# Altium schematic sheet DISPLAYPORT_USBC.SchDoc
size A3
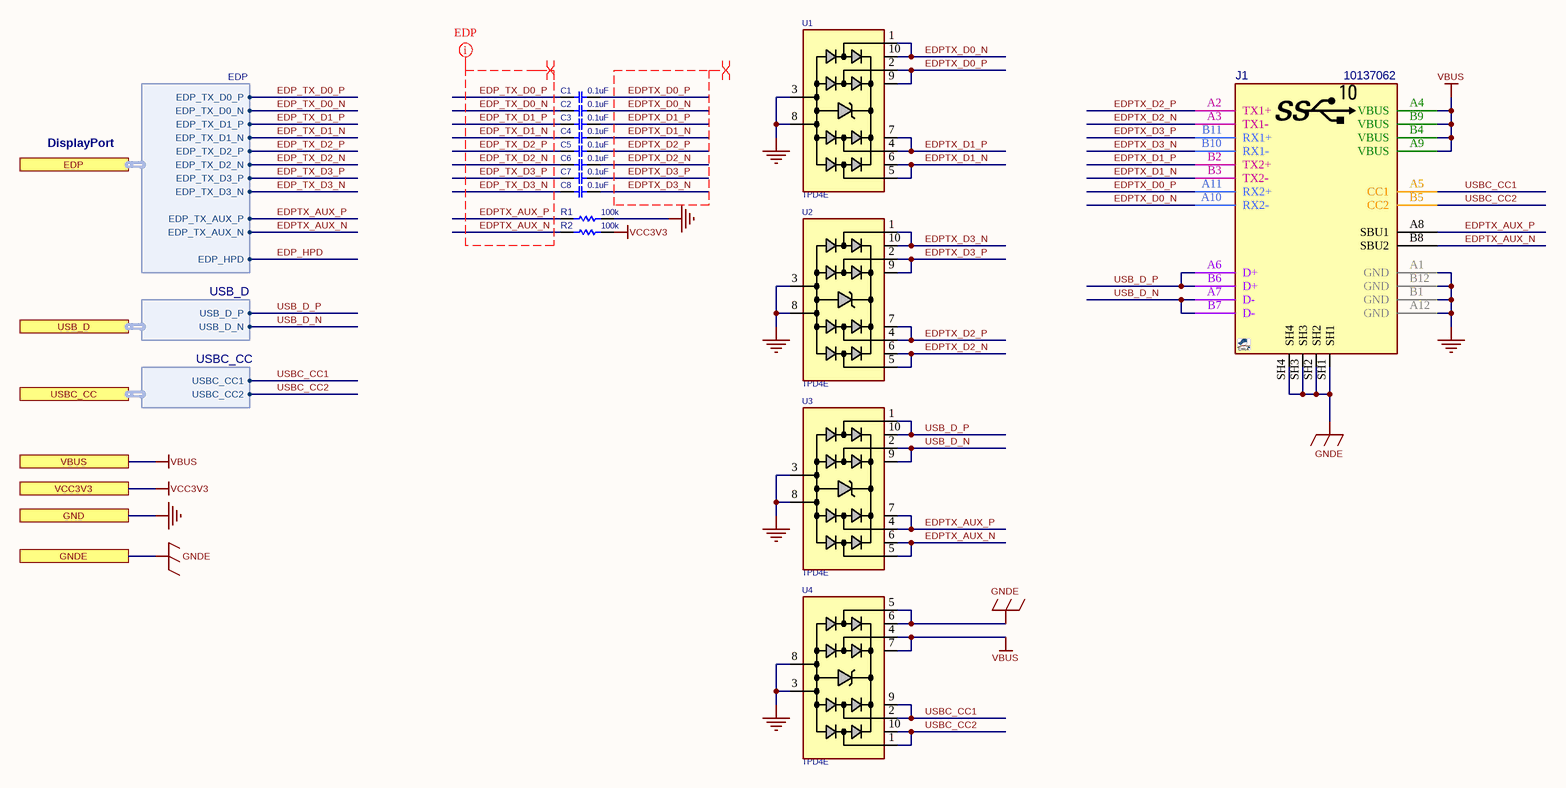
[diagram p0: DISPLAYPORT_USBC.SchDoc]

## Parts
C1  0.1uF  [C0402O2]
C2  0.1uF  [C0402O2]
C3  0.1uF  [C0402O2]
C4  0.1uF  [C0402O2]
C5  0.1uF  [C0402O2]
C6  0.1uF  [C0402O2]
C7  0.1uF  [C0402O2]
C8  0.1uF  [C0402O2]
J1  10137062  [USBC_HYB_10137062]
R1  100k  [R0402]
R2  100k  [R0402]
U1  TPD4E  [SON50_10_2510]
U2  TPD4E  [SON50_10_2510]
U3  TPD4E  [SON50_10_2510]
U4  TPD4E  [SON50_10_2510]

## Ports
EDP (harness EDP), GND, GNDE, USB_D (harness USB_D), USBC_CC (harness USBC_CC), VBUS, VCC3V3

## Harnesses
EDP: EDP_TX_D0_P, EDP_TX_D0_N, EDP_TX_D1_P, EDP_TX_D1_N, EDP_TX_D2_P, EDP_TX_D2_N, EDP_TX_D3_P, EDP_TX_D3_N, EDP_TX_AUX_P, EDP_TX_AUX_N, EDP_HPD
USB_D: USB_D_P, USB_D_N
USBC_CC: USBC_CC1, USBC_CC2

## Nets
GND: J1.A1(GND) J1.A12(GND) J1.B1(GND) J1.B12(GND) R1.1 U1.3 U1.8 U2.3 U2.8 U3.3 U3.8 U4.3 U4.8 ; port GND
GNDE: J1.SH1 J1.SH2 J1.SH3 J1.SH4 U4.5 U4.6 ; port GNDE
VBUS: J1.A4(VBUS) J1.A9(VBUS) J1.B4(VBUS) J1.B9(VBUS) U4.4 U4.7 ; port VBUS
VCC3V3: R2.1 ; port VCC3V3
EDP_HPD: port EDP.EDP_HPD
EDP_TX_D0_N: C2.1 ; port EDP.EDP_TX_D0_N
EDP_TX_D0_P: C1.1 ; port EDP.EDP_TX_D0_P
EDP_TX_D1_N: C4.1 ; port EDP.EDP_TX_D1_N
EDP_TX_D1_P: C3.1 ; port EDP.EDP_TX_D1_P
EDP_TX_D2_N: C6.1 ; port EDP.EDP_TX_D2_N
EDP_TX_D2_P: C5.1 ; port EDP.EDP_TX_D2_P
EDP_TX_D3_N: C8.1 ; port EDP.EDP_TX_D3_N
EDP_TX_D3_P: C7.1 ; port EDP.EDP_TX_D3_P
EDPTX_AUX_N: J1.B8(SBU2) R2.2 U3.5 U3.6 ; port EDP.EDP_TX_AUX_N
EDPTX_AUX_P: J1.A8(SBU1) R1.2 U3.4 U3.7 ; port EDP.EDP_TX_AUX_P
EDPTX_D0_N: C2.2 J1.A10(RX2-) U1.1 U1.10
EDPTX_D0_P: C1.2 J1.A11(RX2+) U1.2 U1.9
EDPTX_D1_N: C4.2 J1.B3(TX2-) U1.5 U1.6
EDPTX_D1_P: C3.2 J1.B2(TX2+) U1.4 U1.7
EDPTX_D2_N: C6.2 J1.A3(TX1-) U2.5 U2.6
EDPTX_D2_P: C5.2 J1.A2(TX1+) U2.4 U2.7
EDPTX_D3_N: C8.2 J1.B10(RX1-) U2.1 U2.10
EDPTX_D3_P: C7.2 J1.B11(RX1+) U2.2 U2.9
USB_D_N: J1.A7(D-) J1.B7(D-) U3.2 U3.9 ; port USB_D.USB_D_N
USB_D_P: J1.A6(D+) J1.B6(D+) U3.1 U3.10 ; port USB_D.USB_D_P
USBC_CC1: J1.A5(CC1) U4.2 U4.9 ; port USBC_CC.USBC_CC1
USBC_CC2: J1.B5(CC2) U4.1 U4.10 ; port USBC_CC.USBC_CC2

## Layout directives
differential pair: EDP_TX_D0_N, EDP_TX_D0_P, EDP_TX_D1_N, EDP_TX_D1_P, EDP_TX_D2_N, EDP_TX_D2_P, EDP_TX_D3_N, EDP_TX_D3_P, EDPTX_AUX_N, EDPTX_AUX_P, EDPTX_D0_N, EDPTX_D0_P, EDPTX_D1_N, EDPTX_D1_P, EDPTX_D2_N, EDPTX_D2_P, EDPTX_D3_N, EDPTX_D3_P
net class EDP: EDP_TX_D0_N, EDP_TX_D0_P, EDP_TX_D1_N, EDP_TX_D1_P, EDP_TX_D2_N, EDP_TX_D2_P, EDP_TX_D3_N, EDP_TX_D3_P, EDPTX_AUX_N, EDPTX_AUX_P

## Notes on the sheet
- DisplayPort

## Library data of the parts
C1-C8 = CAP_SMD_MLCC: CAP, MLCC; PARAM: X5R, 10%; MANF_P#: GRM155R61E104; MANF: Murata; PARAM2: 25v; PRICE: 10,000:	$0.006; ASSEMBLY: ASSEMBLY; VALUE: 0.1uF
J1 = CONN_USBC_HYB_10137062: CONN, USB, Type C, USB 3.1 Gen 1, Right-Angle, HYBRID; MANF: Amphenol; MANF_P#: 10137062-00021LF; PARAM: 5A; Price: None; Value: 10137062
R1 R2 = RES_SMD: RESISTOR, SMD; PARAM: 0.063W; DESC: DESCRIPTION; DIST#: MOUSER; PARAM2: 1%; MANF_P#: -; MANF: -; ASSEMBLY: ASSEMBLY; PRICE: 100= 0.3$; VALUE: 100k; PACKAGE: 0402
U1-U4 = TVS_X4_TPD4E05U06: TVS, ESD PROTECT, 4CH,; MANF_P#: TPD4E05U06DQA; MANF: Texas Instruments; PARAM2: 6.5Vbr, 0.4pF, –40°~125°C; PARAM: ±12-kV ContactD, ±15-kVAirD; PRICE: 0.6$; VALUE: TPD4E